# Altium schematic sheet Sheet1.SchDoc: title
size A3; Author: M.Beldyga; CompanyName: WUT ISE; DrawnBy: M.Beldyga; Organization: WUT ISE; Address1: PW ISE; Address2: Nowowiejska 15/19 00-665 Warsaw; Address3: micbeldyga@gmail.com; SheetNumber: 2; SheetTotal: 2; ModifiedBy: -; CheckedDate: -; Title2: xxx; DivGrp: WUT ISE; Designer: M.Beldyga; ModifiedDate: -; ProjectName: Sensor Box
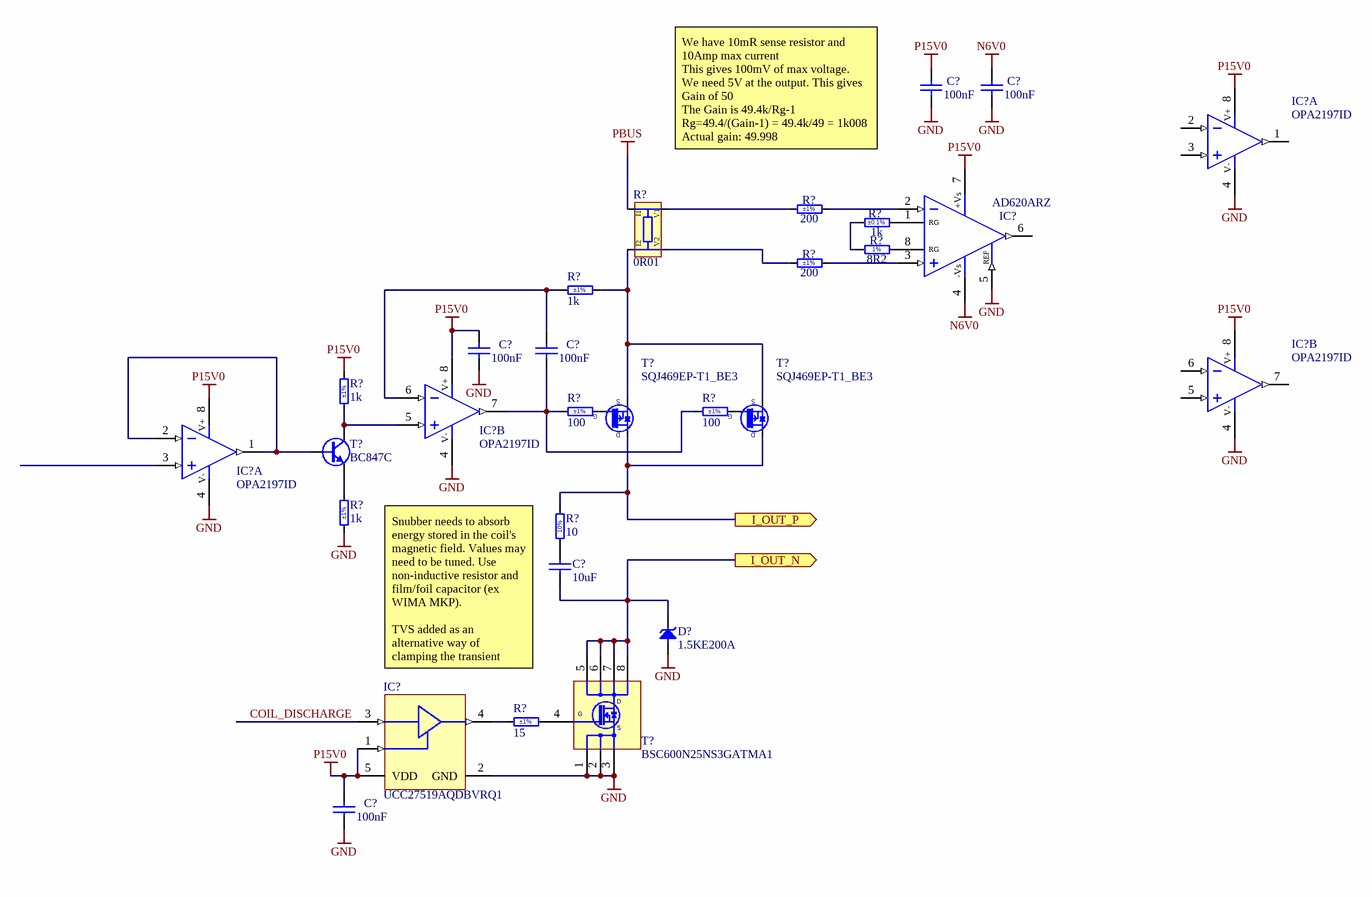
[diagram p0: Sheet1.SchDoc]

## Parts
(Parts that share a designator on the sheet are numbered #1, #2 ... from top to bottom, then left to right.)
C?#1  100nF  [CAPC1005X55N]
C?#2  100nF  [CAPC1005X55N]
C?#3  100nF  [CAPC1005X55N]
C?#4  100nF  [CAPC1005X55N]
C?#5  10uF  [CAPR3750-2400X4200X1800]
C?#6  100nF  [CAPC1005X55N]
D?  1.5KE200A  [DO-201]
IC?#1  OPA2197ID  [SOIC127P600X175-8N]  (part A of 2)
IC?#2  AD620ARZ  [SOIC127P600X175-8N]
IC?#3  OPA2197ID  [SOIC127P600X175-8N]  (part B of 2)
IC?#4  OPA2197ID  [SOIC127P600X175-8N]  (part B of 2)
IC?#5  OPA2197ID  [SOIC127P600X175-8N]  (part A of 2)
IC?#6  UCC27519AQDBVRQ1  [SOT95P280X145-5N]
R?#1  0R01  [RES_OHMITE_LVK25]
R?#2  200  Tolerance: ±1%  [RESC1608X55N]
R?#3  1k  Tolerance: ±0.1%  [RESC1608X55N]
R?#4  8R2  [RESC1608X55N]
R?#5  200  Tolerance: ±1%  [RESC1608X55N]
R?#6  1k  Tolerance: ±1%  [RESC1005X40N]
R?#7  1k  Tolerance: ±1%  [RESC1005X40N]
R?#8  100  Tolerance: ±1%  [RESC1005X40N]
R?#9  100  Tolerance: ±1%  [RESC1005X40N]
R?#10  1k  Tolerance: ±1%  [RESC1005X40N]
R?#11  10  [RES_OHMITE_OY]
R?#12  15  Tolerance: ±1%  [RESC3216X65N]
T?#1  SQJ469EP-T1_BE3  [PowerPAK® SO-8L SINGLE]
T?#2  SQJ469EP-T1_BE3  [PowerPAK® SO-8L SINGLE]
T?#3  BC847C  [SOT95P240X110-3N]
T?#4  BSC600N25NS3GATMA1  [INFINEON_PG-TDSON-8]

## Ports
I_OUT_N (out), I_OUT_P (out)

## Nets
GND: C?#1.1 C?#2.1 C?#3.1 C?#6.1 D?.2(A) IC?#1.4(V-) IC?#2.5(REF) IC?#3.4(V-) IC?#4.4(V-) IC?#5.4(V-) IC?#6.2(GND) R?#10.1 T?#4.1(S) T?#4.2(S) T?#4.3(S)
N6V0: C?#2.2 IC?#2.4(-Vs)
P15V0: C?#1.2 C?#3.2 C?#6.2 IC?#1.8(V+) IC?#2.7(+Vs) IC?#3.8(V+) IC?#4.8(V+) IC?#5.8(V+) IC?#6.1(ENA) IC?#6.5(VDD) R?#7.2
PBUS: R?#1.I1
COIL_DISCHARGE: IC?#6.3(IN+/IN-)
I_OUT_N: C?#5.1 D?.1(C) T?#4.D ; port I_OUT_N
I_OUT_P: R?#11.2 T?#1.3(D) T?#2.3(D) ; port I_OUT_P
NetC?#4_1: C?#4.1 IC?#4.7(OUT) R?#8.1 R?#9.1
NetC?#4_2: C?#4.2 IC?#4.6(IN-) R?#6.1
NetC?#5_2: C?#5.2 R?#11.1
NetIC?#2_1: IC?#2.1(-RG) R?#3.2
NetIC?#2_2: IC?#2.2(-IN) R?#2.2
NetIC?#2_3: IC?#2.3(+IN) R?#5.2
NetIC?#2_8: IC?#2.8(+RG) R?#4.2
NetIC?#4_5: IC?#4.5(IN+) R?#7.1 T?#3.3(C)
NetIC?#5_1: IC?#5.1(OUT) IC?#5.2(IN-) T?#3.1(B)
NetIC?#6_4: IC?#6.4(OUT) R?#12.1
NetR?#1_I2: R?#1.I2 R?#6.2 T?#1.2(S) T?#2.2(S)
NetR?#1_V1: R?#1.V1 R?#2.1
NetR?#1_V2: R?#1.V2 R?#5.1
NetR?#3_1: R?#3.1 R?#4.1
NetR?#8_2: R?#8.2 T?#1.1(G)
NetR?#9_2: R?#9.2 T?#2.1(G)
NetR?#10_2: R?#10.2 T?#3.2(E)
NetR?#12_2: R?#12.2 T?#4.4(G)

Not connected (* = marked no-connect by the designer): IC?#1 1(OUT) 2(IN-) 3(IN+); IC?#2 6(Vout); IC?#3 5(IN+) 6(IN-) 7(OUT); IC?#5 3(IN+)

## Notes on the sheet
- We have 10mR sense resistor and 10Amp max current
  This gives 100mV of max voltage.
  We need 5V at the output. This gives Gain of 50
  The Gain is 49.4k/Rg-1
  Rg=49.4/(Gain-1) = 49.4k/49 = 1k008
  Actual gain: 49.998
- Snubber needs to absorb energy stored in the coil's magnetic field. Values may need to be tuned. Use non-inductive resistor and film/foil capacitor (ex WIMA MKP).
  TVS added as an alternative way of clamping the transient
- Project/Equipment
- Document
- Designer
- Drawn by
- Check.by
- Contact
- File
- Last Mod.
- Print Date
- Sheet
- Size
- A3
- of
- Rev
- (in symbol AD620ARZ) RG
- (in symbol BSC600N25NS3GATMA1) 5; 6; 7
- (in symbol R0603_8R2_1%_0.1W_200PPM) 1%
- (in symbol RCF_10R_10%_2W_-1300±300PPM_OHMITE_OY) 10%

## Library data of the parts
C?#1-C?#4 C?#6 = CC0402_100NF_16V_10%_X5R: Non-polarised capacitor; Part Description: SMD Multilayer Chip Ceramic Capacitor; Manufacturer: GENERIC; Manufacturer1 Part Number: GRM155R61C104KA88D; Voltage: 16V; TC: X5R; Tolerance: ±10%; Part Number: CC0402_100NF_16V_10%_X5R; Component Kind: Standard; Component Type: Standard; Pin Count: 2; Value: 100nF; Status: None; Manufacturer Part Number: CC0402_100NF_16V_10%_X5R; Case: 0402; Mounted: Yes; Socket: No; SMD: Yes; Sense: No; Manufacturer1 Example: MURATA; Manufacturer1 ComponentHeight: 0.55mm; HelpURL: \\cern.ch\dfs\Applications\Altium\Datasheets\CC0402_X5R_MURATA_GRM.pdf; Author: CERN DEM JLC; CreateDate: 10.12.2013; LatestRevisionDate: 10.12.2013
C?#5 = CPPR_10UF_500V_5%_VISHAY_MKP1848S61050JP2C: Non-polarised capacitor; Part Description: Metallized Polypropylene Film Capacitor (MKP1848S DC-Link); Manufacturer: VISHAY ROEDERSTEIN; Voltage: 500VDC; Tolerance: ±5%; Part Number: CPPR_10UF_500V_5%_VISHAY_MKP1848S61050JP2C; Component Kind: Standard; Component Type: Standard; Pin Count: 2; Value: 10uF; Status: None; Manufacturer Part Number: MKP1848S61050JP2C; Case: LS37.5 W24 x L42 x H18; Mounted: Yes; Socket: No; SMD: No; Sense: No; ComponentHeight: 18mm; HelpURL: \\cern.ch\dfs\Applications\Altium\Datasheets\CPPR_VISHAY_MKP1848S DC-Link.pdf; Author: CERN DEM JLC; CreateDate: 10/23/2013; LatestRevisionDate: 10/23/2013
D? = 1.5KE200A: Transient Voltage Suppressor Diode (Uni-Directional); Part Description: Uni-directional  Transient Voltage Suppressor Diode - Transil; Manufacturer: LITTELFUSE; Voltage: 200V; Power: 1500W; PressFit: No; Bonding: No; Part Number: 1.5KE200A; Component Kind: Standard; Component Type: Standard; Device: 1.5KE200A; PackageDescription: DO-201, Diode, Axial; Lead Spacing 20.32mm, Lead Dia. 1.07mm, Body Length 9mm, Body Dia. 5.05mm; Manufacturer Part Number: 1.5KE200A; Pin Count: 2; Mounted: Yes; Socket: No; SMD: No; Sense: No; ComponentHeight: 5.3mm; HelpURL: \\cern.ch\dfs\Applications\Altium\Datasheets\1.5KE.pdf; Author: CERN DEM MR; CreateDate: 7/18/2016; LatestRevisionDate: 1/17/2018
IC?#1 IC?#3-IC?#5 = OPA2197ID: Dual Operational Amplifier; Part Description: Dual, 36-V, Precision, Rail-to-Rail Input/Output, Low Offset Voltage, Operational Amplifiers; Manufacturer: TEXAS INSTRUMENTS; PressFit: No; Bonding: No; Part Number: OPA2197ID; Component Kind: Standard; Component Type: Standard; Device: OPA2197ID; PackageDescription: SOIC 8, Pitch 1.27mm - Body 4x5mm, IPC Medium Density; Manufacturer Part Number: OPA2197ID; Pin Count: 8; Case: SOIC8; Mounted: Yes; Socket: No; SMD: Yes; Sense: No; ComponentHeight: 1.75mm; Author: CERN DEM MR; HelpURL: \\cern.ch\dfs\Applications\Altium\Datasheets\OPA2197ID.pdf; CreateDate: 8/7/2019; LatestRevisionDate: 8/7/2019
IC?#2 = AD620ARZ: Low Cost Low Power Instrumentation Amplifier; Manufacturer1: ANALOG DEVICES; Manufacturer1 Part Number: AD620ARZ-REEL7; PressFit: No; Bonding: No; Part Number: AD620ARZ; Component Kind: Standard; Component Type: Standard; Device: AD620ARZ; PackageDescription: SOIC 8, Pitch 1.27mm - Body 4x5mm, IPC Medium Density; Part Description: Low Cost Low Power Instrumentation Amplifier; Pin Count: 8; Case: SOIC8; Mounted: Yes; Socket: No; SMD: Yes; Sense: No; ComponentHeight: 1.75mm; Author: CERN DEM JLC; HelpURL: \\cern.ch\dfs\Applications\Altium\Datasheets\AD620ARZ.pdf; CreateDate: 13.02.2017; LatestRevisionDate: 29.03.2022
IC?#6 = UCC27519AQDBVRQ1: Single-Channel High-Speed Low-Side Gate Driver With Negative Input  Voltage Capability; Manufacturer: TEXAS INSTRUMENTS; PressFit: No; Bonding: No; Part Number: UCC27519AQDBVRQ1; Component Kind: Standard; Component Type: Standard; Device: UCC27519AQDBVRQ1; PackageDescription: SOT, 0.95mm Pitch; 5 pin, 1.60mm W X 2.90mm L X 1.45mm H body, IPC Medium Density; Part Description: Single-Channel High-Speed Low-Side Gate Driver with Negative Input  Voltage Capability; Manufacturer Part Number: UCC27519AQDBV; Pin Count: 5; Case: SOT23-5; Mounted: Yes; Socket: No; SMD: Yes; Sense: No; ComponentHeight: 1.45mm; Author: CERN DEM JLC; HelpURL: \\cern.ch\dfs\Applications\Altium\Datasheets\UCC27519AQDBVRQ1.pdf; CreateDate: 7/16/2018; LatestRevisionDate: 6/13/2022
R?#1 = R_0R01_1%_2W_100PPM_OHMITE_LVK25: Power and Current Sensing Resistor; Part Description: Four Terminal High Precision Current Sense; Manufacturer: OHMITE; Manufacturer Part Number: LVK25R010FER; Power: 2W; TC: ±100ppm/°C; Tolerance: ±1%; PressFit: No; Part Number: R_0R01_1%_2W_100PPM_OHMITE_LVK25; Component Kind: Standard; Component Type: Standard; Pin Count: 4; Value: 0R01; Status: None; Mounted: Yes; Sense: No; Socket: No; SMD: Yes; ComponentHeight: 0.7mm; HelpURL: \\cern.ch\dfs\Applications\Altium\Datasheets\R_OHMITE_LVK25.pdf; Author: CERN DEM BC; CreateDate: 9/7/2020; LatestRevisionDate: 9/7/2020
R?#2 R?#5 = R0603_200R_1%_0.1W_100PPM: Resistor - 1%; Part Description: General Purpose Thick Film Chip Resistor; Manufacturer: GENERIC; Manufacturer1: Vishay; Manufacturer1 Part Number: CRCW0603200RFKEA; Power: 0.1W; TC: ±100ppm/°C; PressFit: No; Part Number: R0603_200R_1%_0.1W_100PPM; Component Kind: Standard; Component Type: Standard; Pin Count: 2; Value: 200; Status: Preferred; Manufacturer Part Number: R0603_200R_1%_0.1W_100PPM; Case: 0603; Mounted: Yes; Sense: No; Socket: No; SMD: Yes; Manufacturer1 ComponentHeight: 0.55mm; HelpURL: \\cern.ch\dfs\Applications\Altium\Datasheets\R0603_NIC_NRC.pdf; Author: CERN DEM JLC; CreateDate: 03.12.2007; LatestRevisionDate: 13.03.2008
R?#3 = R0603_1K_0.1%_0.063W_10PPM: Resistor - 0.1%; Part Description: Thin Film Chip Resistor; Manufacturer: GENERIC; Manufacturer1: TYCO HOLSWORTHY; Manufacturer1 Part Number: RN73C1J1K0BTG; Power: 0.063W; TC: ±10ppm; PressFit: No; Part Number: R0603_1K_0.1%_0.063W_10PPM; Component Kind: Standard; Component Type: Standard; Pin Count: 2; Value: 1k; Status: Not Recommended; Manufacturer Part Number: R0603_1K_0.1%_0.063W_10PPM; Case: 0603; Mounted: Yes; Sense: No; Socket: No; SMD: Yes; Manufacturer1 ComponentHeight: 0.55mm; HelpURL: \\cern.ch\dfs\Applications\Altium\Datasheets\R0603_Tyco_RN73.pdf; Author: CERN DEM BC; CreateDate: 23.05.2016; LatestRevisionDate: 23.05.2016
R?#4 = R0603_8R2_1%_0.1W_200PPM: Resistor - 1%; Part Description: General Purpose Thick Film Chip Resistor; Manufacturer: GENERIC; Manufacturer1: YAGEO PHYCOMP; Manufacturer1 Part Number: RC0603FR-078R2L; Power: 0.1W; TC: ±200ppm/°C; PressFit: No; Part Number: R0603_8R2_1%_0.1W_200PPM; Component Kind: Standard; Component Type: Standard; Pin Count: 2; Value: 8R2; Status: Preferred; Tolerance: ±1%; Manufacturer Part Number: R0603_8R2_1%_0.1W_200PPM; Case: 0603; Mounted: Yes; Sense: No; Socket: No; SMD: Yes; Manufacturer1 ComponentHeight: 0.65mm; HelpURL: \\cern.ch\dfs\Applications\Altium\Datasheets\R0603_Phycomp_RC0603.pdf; Author: CERN DEM JLC; CreateDate: 03/12/2007; LatestRevisionDate: 17/10/2012
R?#6 R?#7 R?#10 = R0402_1K_1%_0.0625W_100PPM: Resistor - 1%; Part Description: General Purpose Thick Film Chip Resistor; Manufacturer: GENERIC; Manufacturer1 Part Number: 232270671002L; TC: ±100ppm/°C; PressFit: No; Part Number: R0402_1K_1%_0.0625W_100PPM; Component Kind: Standard; Component Type: Standard; Pin Count: 2; Value: 1k; Status: Not Recommended; Power: 0.0625W; Manufacturer Part Number: R0402_1K_1%_0.0625W_100PPM; Case: 0402; Mounted: Yes; Sense: No; Socket: No; SMD: Yes; Manufacturer1 Example: YAGEO PHYCOMP; Manufacturer1 ComponentHeight: 0.4mm; HelpURL: \\cern.ch\dfs\Applications\Altium\Datasheets\R0402_Phycomp_RC0402.pdf; Author: CERN DEM JLC; CreateDate: 12/3/2007; LatestRevisionDate: 10/17/2012
R?#8 R?#9 = R0402_100R_1%_0.0625W_100PPM: Resistor - 1%; Part Description: General Purpose Thick Film Chip Resistor; Manufacturer: GENERIC; Manufacturer1 Part Number: 232270671001L; TC: ±100ppm/°C; PressFit: No; Part Number: R0402_100R_1%_0.0625W_100PPM; Component Kind: Standard; Component Type: Standard; Pin Count: 2; Value: 100; Status: Not Recommended; Power: 0.0625W; Manufacturer Part Number: R0402_100R_1%_0.0625W_100PPM; Case: 0402; Mounted: Yes; Sense: No; Socket: No; SMD: Yes; Manufacturer1 Example: YAGEO PHYCOMP; Manufacturer1 ComponentHeight: 0.4mm; HelpURL: \\cern.ch\dfs\Applications\Altium\Datasheets\R0402_Phycomp_RC0402.pdf; Author: CERN DEM JLC; CreateDate: 12/3/2007; LatestRevisionDate: 10/17/2012
R?#11 = RCF_10R_10%_2W_-1300±300PPM_OHMITE_OY: Resistor - 10%; Part Description: Ceramic Composition Resistor - OY Series; Manufacturer: OHMITE; Manufacturer Part Number: OY100KE; Power: 2W; TC: -1300±300ppm/°C; PressFit: No; Part Number: RCF_10R_10%_2W_-1300±300PPM_OHMITE_OY; Component Kind: Standard; Component Type: Standard; Pin Count: 2; Value: 10; Status: Not recommended; Tolerance: ±10%; Case: LS30 L22.5 x D8; Mounted: Yes; Sense: No; Socket: No; SMD: No; ComponentHeight: 8mm; HelpURL: \\cern.ch\dfs\Applications\Altium\Datasheets\RCF_OHMITE_OY.pdf; Author: CERN DEM MR; CreateDate: 5/13/2016; LatestRevisionDate: 5/13/2016
R?#12 = R1206_15R_1%_0.25W_100PPM: Resistor - 1%; Part Description: General Purpose Thick Film Chip Resistor; Manufacturer: GENERIC; Manufacturer1 Part Number: NRC12F15R0TRF; Power: 0.25W; TC: ±100ppm/°C; PressFit: No; Part Number: R1206_15R_1%_0.25W_100PPM; Component Kind: Standard; Component Type: Standard; Pin Count: 2; Value: 15; Status: Preferred; Manufacturer Part Number: R1206_15R_1%_0.25W_100PPM; Case: 1206; Mounted: Yes; Sense: No; Socket: No; SMD: Yes; Manufacturer1 Example: NIC COMPONENT; Manufacturer1 ComponentHeight: 0.65mm; HelpURL: \\cern.ch\dfs\Applications\Altium\Datasheets\R1206_NIC_NRC.pdf; Author: CERN DEM JLC; CreateDate: 12/3/2007; LatestRevisionDate: 3/13/2008
T?#3 = BC847C: NPN Transistor; Part Description: 45V 100mA NPN Silicon AF Transistor; Manufacturer: INFINEON; PressFit: No; Bonding: No; Part Number: BC847C; Component Kind: Standard; Component Type: Standard; Device: BC847C; PackageDescription: SOT23, 0.95mm Pitch; 3 Pin, 1.40mm W X 3.00mm L X 1.10mm H body, IPC Medium Density; Manufacturer Part Number: BC847C; Pin Count: 3; Case: SOT23-3; Mounted: Yes; Socket: No; SMD: Yes; Sense: No; ComponentHeight: 1.1mm; HelpURL: \\cern.ch\dfs\Applications\Altium\Datasheets\BC847C.pdf; Author: CERN DEM JLC; CreateDate: 9/23/2014; LatestRevisionDate: 9/23/2014
T?#4 = BSC600N25NS3GATMA1: MOSFET Transistor, N Channel, 25 A, 250 V, 0.05 ohm, 10 V, 3 V; Manufacturer: Infineon; Continuous Drain Current (ID): 25A; Drain to Source Resistance: 60mΩ; Drain to Source Voltage (Vdss): 250V; Gate to Source Voltage (Vgs): 20V; Input Capacitance: 1.77nF; Max Power Dissipation: 125W; Number of Elements: 1; Rise Time: 10ns; Supplier: DigiKey; Supplier Part Number: BSC600N25NS3GATMA1CT-ND; Manufacturer Part Number: BSC600N25NS3GATMA1; RoHS: Compliant; Category: MOSFETs; Stock: 12980; Pricing: 1=4.08, 10=2.681, 100=1.8868, 500=1.70212, 5000=1.39062 (USD); China RoHS: Non-Compliant; Contact Plating: Tin; Country of Origin: Malaysia; Export Control Classification Number (ECCN) Code: EAR99; Halogen Free: Halogen Free; Introduction Date: 2009-10-23; Lead Free: Contains Lead; Lifecycle Status: Production; Max Dual Supply Voltage: 250V; Max Operating Temperature: 150°C; Min Breakdown Voltage: 250V; Min Operating Temperature: -55°C; Mounting Technology: Surface Mount; Pins: 8; Number of Terminals: 8; On-State Resistance: 60mΩ; Package Quantity: 5000; Packaging: Tape & Reel; Power Dissipation: 125W; REACH SVHC: No; Schedule B: 8541290080, 8541290080|8541290080|8541290080|8541290080|8541290080; ComponentLink1URL: https://datasheet.octopart.com:443/BSC600N25NS3GATMA1-Infineon-datasheet-13720809.pdf?src-supplier=Newark; ComponentLink1Description: https://datasheet.octopart.com:443/BSC600N25NS3GATMA1-Infineon-datasheet-13720809.pdf?src-supplier=Newark; ComponentLink2URL: https://datasheet.octopart.com:443/BSC600N25NS3-G-Infineon-datasheet-11795221.pdf?src-supplier=Farnell; ComponentLink2Description: https://datasheet.octopart.com:443/BSC600N25NS3-G-Infineon-datasheet-11795221.pdf?src-supplier=Farnell; ComponentLink3URL: http://sigma.octopart.com:80/conflict_mineral_statement/Infineon-company-51.pdf?src-supplier=Compliance+Statements; ComponentLink3Description: http://sigma.octopart.com:80/conflict_mineral_statement/Infineon-company-51.pdf?src-supplier=Compliance+Statements